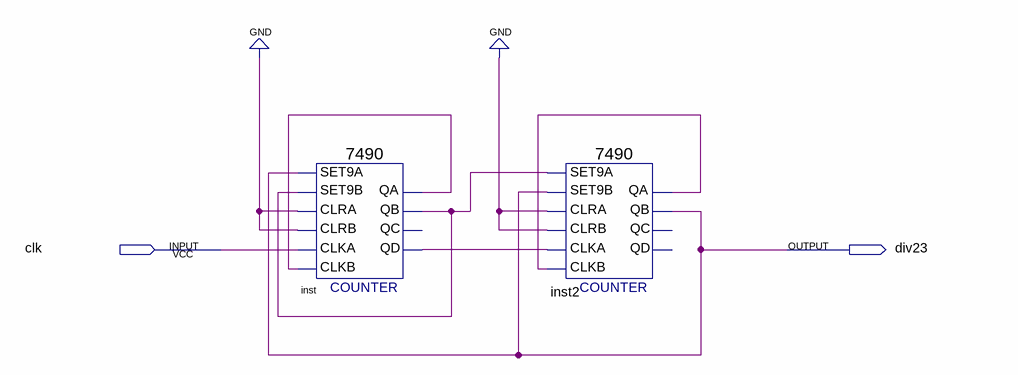
[diagram p0: schematic sheet]
// Quartus schematic div_23.bdf as structural Verilog: 2 symbols, 2 pins
module div_23 (
  input  clk,
  output div23
);

  wire inst2_qa, inst_qa, inst_qb, inst_qd;

  \7490  inst (
    .SET9A(div23), .CLRA(1'b0), .SET9B(inst_qb), .CLKB(inst_qa), .CLKA(clk), .CLRB(1'b0), .QD(inst_qd),
    .QA(inst_qa), .QB(inst_qb));  // open: QC
  \7490  inst2 (
    .SET9A(inst_qb), .CLRA(1'b0), .SET9B(div23), .CLKB(inst2_qa), .CLKA(inst_qd), .CLRB(1'b0), .QA(inst2_qa),
    .QB(div23));  // open: QD, QC
endmodule
